# EAGLE design MonkeyParty7.1 (EAGLE 6.4)
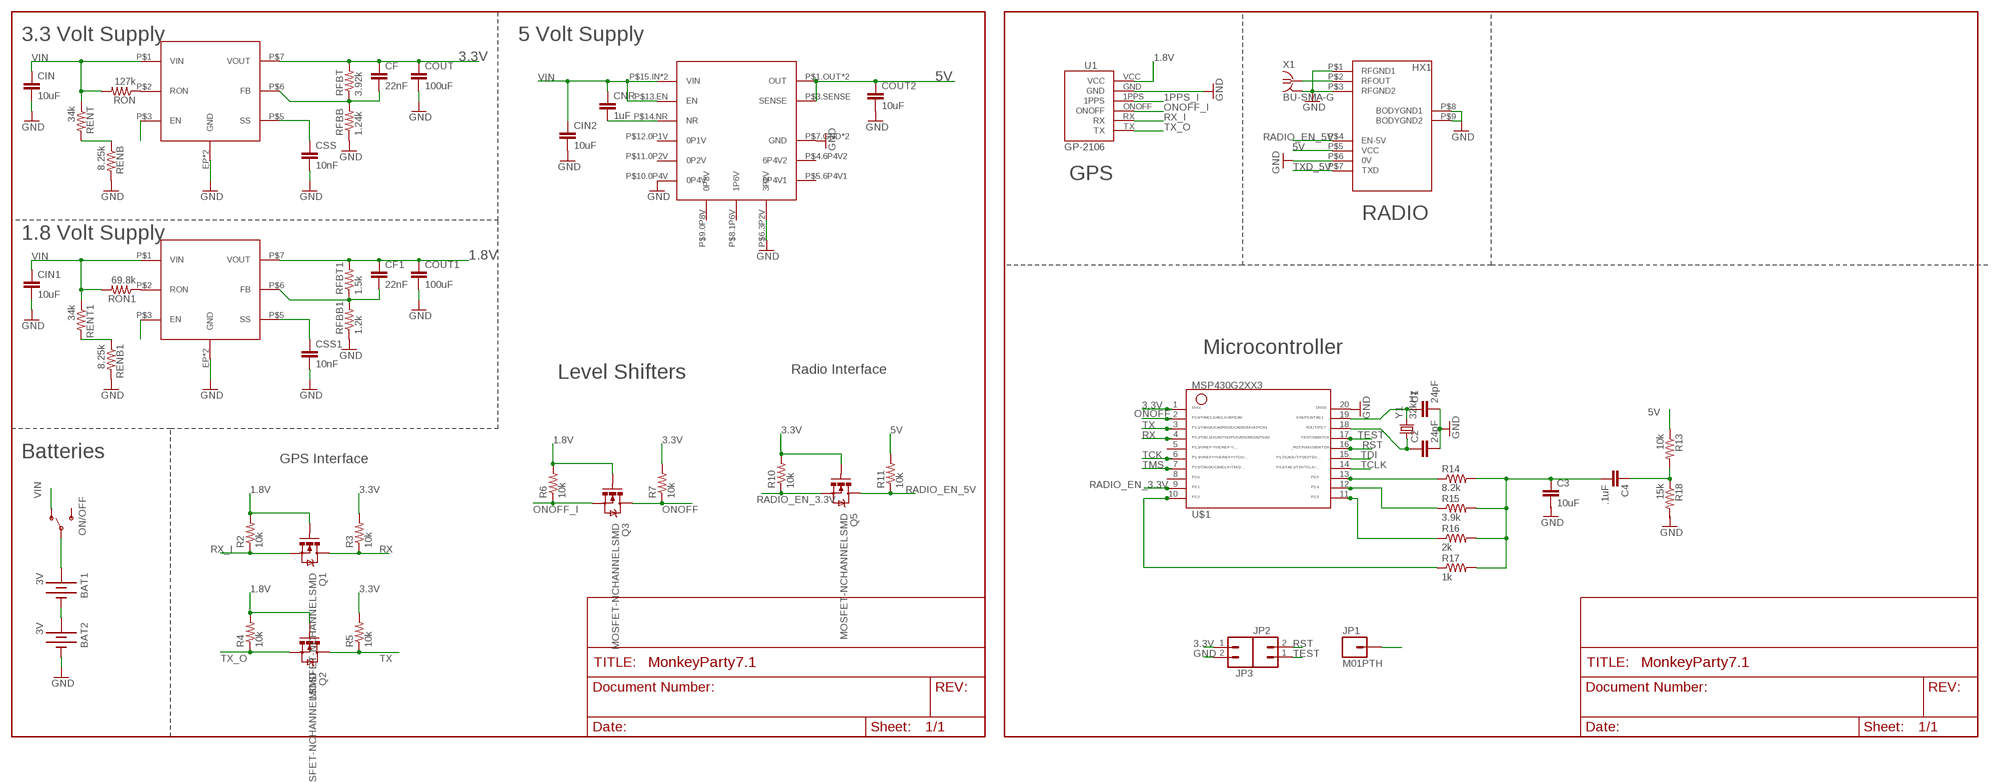
[diagram p0: schematic, sheet 1]

## Parts
1.8VREG  LMZ12001  [TO-PMOD7PIN]
3.3VREG  LMZ12001  [TO-PMOD7PIN]
5VREG  TPS7A4700  [S-PVQFN-N20]
BAT1  3V  BATTERY245MM  [BATTCON_245MM]
BAT2  3V  BATTERY245MM  [BATTCON_245MM]
C1  24pF  CAP1210  [1210]
C2  24pF  CAP1210  [1210]
C3  10uF  CAP0805  [0805]
C4  .1uF  CAP0805  [0805]
CF  22nF  CAP0805  [0805]
CF1  22nF  CAP0805  [0805]
CIN  10uF  CAP0805  [0805]
CIN1  10uF  CAP0805  [0805]
CIN2  10uF  CAP0805  [0805]
CNR  1uF  CAP0805  [0805]
COUT  100uF  CAP1210  [1210]
COUT1  100uF  CAP1210  [1210]
COUT2  10uF  CAP0805  [0805]
CSS  10nF  CAP1210  [1210]
CSS1  10nF  CAP1210  [1210]
JP1  M01PTH  [1X01]
JP2  M02PTH  [1X02]
JP3  M02PTH  [1X02]
ON/OFF  SWITCH-SPSTKIT  [SWITCH-SPDT_KIT]
Q1  MOSFET-NCHANNELSMD  [SOT23-3]
Q2  MOSFET-NCHANNELSMD  [SOT23-3]
Q3  MOSFET-NCHANNELSMD  [SOT23-3]
Q5  MOSFET-NCHANNELSMD  [SOT23-3]
R2  10k  RESISTOR0805-RES  [0805]
R3  10k  RESISTOR0805-RES  [0805]
R4  10k  RESISTOR0805-RES  [0805]
R5  10k  RESISTOR0805-RES  [0805]
R6  10k  RESISTOR0805-RES  [0805]
R7  10k  RESISTOR0805-RES  [0805]
R10  10k  RESISTOR0805-RES  [0805]
R11  10k  RESISTOR0805-RES  [0805]
R13  10k  RESISTOR0805-RES  [0805]
R14  8.2k  RESISTOR0805-RES  [0805]
R15  3.9k  RESISTOR0805-RES  [0805]
R16  2k  RESISTOR0805-RES  [0805]
R17  1k  RESISTOR0805-RES  [0805]
R18  15k  RESISTOR0805-RES  [0805]
RENB  8.25k  RESISTOR0805-RES  [0805]
RENB1  8.25k  RESISTOR0805-RES  [0805]
RENT  34k  RESISTOR0805-RES  [0805]
RENT1  34k  RESISTOR0805-RES  [0805]
RFBB  1.24k  RESISTOR0805-RES  [0805]
RFBB1  1.2k  RESISTOR0805-RES  [0805]
RFBT  3.92k  RESISTOR0805-RES  [0805]
RFBT1  1.5k  RESISTOR0805-RES  [0805]
RON  127k  RESISTOR0805-RES  [0805]
RON1  69.8k  RESISTOR0805-RES  [0805]
U1  GP-2106  [GP-2106]
U$1  G2XX3---PW20  [PW20]
U$2  HX1  [HX1]
X1  BU-SMA-G  [BU-SMA-G]
Y1  32kHz  CRYSTAL32-SMD  [CRYSTAL-32KHZ-SMD]

## Nets
1.8V: 1.8VREG.P$7(VOUT) CF1.1 COUT1.1 Q1.1(G) Q2.1(G) Q3.1(G) R2.2 R4.2 R6.2 RFBT1.2 U1.VCC
1PPS_I: U1.1PPS
3.3V: 3.3VREG.P$7(VOUT) CF.1 COUT.1 JP3.1 Q5.1(G) R3.2 R5.2 R7.2 R10.2 RFBT.2 U$1.1
5V: 5VREG.P$1.OUT(OUT) 5VREG.P$3.SENSE(SENSE) 5VREG.P$20.OUT(OUT) COUT2.1 R11.2 R13.1 U$2.P$5(VCC)
GND: 1.8VREG.EP(GND) 1.8VREG.P$4(GND) 3.3VREG.EP(GND) 3.3VREG.P$4(GND) 5VREG.P$6.3P2V(3P2V) 5VREG.P$7.GND(GND) 5VREG.P$10.0P4V(0P4V) 5VREG.P$21.GND(GND) BAT2.2(-) C1.2 C2.2 CIN1.2 CIN2.2 CIN.2 COUT1.2 COUT2.2 COUT.2 CSS1.2 CSS.2 JP3.2 RENB1.2 RENB.2 RFBB1.1 RFBB.1 U1.GND U$1.20 U$2.P$1(RFGND1) U$2.P$3(RFGND2) U$2.P$6(0V) U$2.P$8(BODYGND1) U$2.P$9(BODYGND2) X1.2 X1.3 X1.4 X1.5
N$1: 3.3VREG.P$2(RON) RON.1
N$2: U$2.P$2(RFOUT) X1.1
N$3: RENB.1 RENT.2
N$4: BAT1.2(-) BAT2.1(+)
N$5: 3.3VREG.P$5(SS) CSS.1
N$6: 3.3VREG.P$6(FB) CF.2 RFBB.2 RFBT.1
N$7: 1.8VREG.P$2(RON) RON1.1
N$8: BAT1.1(+) ON/OFF.2(P)
N$9: RENB1.1 RENT1.2
N$10: 1.8VREG.P$5(SS) CSS1.1
N$11: 1.8VREG.P$6(FB) CF1.2 RFBB1.2 RFBT1.1
N$12: 5VREG.P$14.NR(NR) CNR.2
N$14: C1.1 U$1.19 Y1.X2
N$16: C2.1 U$1.18 Y1.X1
N$20: R14.1 U$1.13
N$21: R15.1 U$1.12
N$22: R16.1 U$1.11
N$23: R17.1 U$1.10
ONOFF: Q3.3(D) R7.1 U$1.2
ONOFF_I: Q3.2(S) R6.1 U1.ONOFF
RADIO_EN_3.3V: Q5.2(S) R10.1 U$1.9
RADIO_EN_5V: Q5.3(D) R11.1 U$2.P$4(EN-5V)
RST: JP2.2 U$1.16
RX: Q1.3(D) R3.1 U$1.4
RX_I: Q1.2(S) R2.1 U1.RX
TCK: U$1.6
TCLK: U$1.14
TDI: U$1.15
TEST: JP2.1 U$1.17
TMS: U$1.7
TX: Q2.3(D) R5.1 U$1.3
TX_O: Q2.2(S) R4.1 U1.TX
TXD_3.3V: C3.1 C4.2 R14.2 R15.2 R16.2 R17.2
TXD_5V: C4.1 R13.2 R18.1 U$2.P$7(TXD)
VIN: 1.8VREG.P$1(VIN) 1.8VREG.P$3(EN) 3.3VREG.P$1(VIN) 3.3VREG.P$3(EN) 5VREG.P$13.EN(EN) 5VREG.P$15.IN(VIN) 5VREG.P$16.IN(VIN) CIN1.1 CIN2.1 CIN.1 CNR.1 JP1.1 ON/OFF.1(O) RENT1.1 RENT.1 RON1.2 RON.2
Unconnected: 5VREG.P$4.6P4V2(6P4V2) 5VREG.P$5.6P4V1(6P4V1) 5VREG.P$8.1P6V(1P6V) 5VREG.P$9.0P8V(0P8V) 5VREG.P$11.0P2V(0P2V) 5VREG.P$12.0P1V(0P1V) C3.2 ON/OFF.3(S) R18.2 U$1.5 U$1.8

## Notes on the sheet
- 3.3 Volt Supply | 5 Volt Supply
- GPS
- RADIO
- 1.8 Volt Supply
- Microcontroller
- Radio Interface
- Level Shifters
- Batteries
- GPS Interface

## Library data of the parts
1.8VREG 3.3VREG = Senior Design:LMZ12001
5VREG = Senior Design:TPS7A4700
BAT1 BAT2 = SparkFun:BATTERY: Battery Holders Various common sizes : AA, AAA, 20mm coin cell and 12mm coin cell.
C1 C2 CF CF1 CIN CIN1 CIN2 CNR COUT COUT1 COUT2 CSS CSS1 = SparkFun:CAP: Capacitor Standard 0603 ceramic capacitor, and 0.1" leaded capacitor.
C3 C4 = SparkFun-Capacitors:CAP: Capacitor Standard 0603 ceramic capacitor, and 0.1" leaded capacitor.
JP1 = SparkFun:M01: Header 1 Standard 1-pin 0.1" header. Use with straight break away headers (SKU : PRT-00116), right angle break away headers (PRT-00553), swiss pins (PRT-00743), machine pins (PRT-00117), and female headers (PRT-00115).
JP2 JP3 = SparkFun:M02: Header 2 Standard 2-pin 0.1" header. Use with straight break away headers (SKU : PRT-00116), right angle break away headers (PRT-00553), swiss pins (PRT-00743), machine pins (PRT-00117), and female headers (PRT-00115). Molex polarized connector foot print use with SKU : PRT-08233 with associated crimp pins and housings.
ON/OFF = SparkFun:SWITCH-SPST: SPST Switch Simple slide switch. Spark Fun Electronics SKU : COM-00102
Q1-Q3 Q5 = SparkFun:MOSFET-NCHANNEL
R2-R7 R10 R11 R14-R17 RENB RENB1 RENT RENT1 RFBB RFBB1 RFBT RFBT1 RON RON1 = SparkFun:RESISTOR: Resistor Basic schematic elements and footprints for 0603, 1206, and PTH resistors.
R13 R18 = SparkFun-Resistors:RESISTOR: Resistor Basic schematic elements and footprints for 0603, 1206, and PTH resistors.
U1 = SparkFun:GP-2106: GP-2106 GPS SiRF IV
U$1 = TI_MSP430_v16:G2XX3---PW20: MSP430G2XX1 TSSOP (PW) 20 Pin Package
U$2 = HX1:HX1: Radiometrix HX1
X1 = con-coax:BU-SMA-G: FEMALE SMA CONNECTOR Radiall distributor RS 193-9117; OC_FARNELL: unknown; OC_NEWARK: unknown
Y1 = SparkFun:CRYSTAL: Crystals Various standard crystals. Proven footprints. Spark Fun Electronics SKU : COM-00534

## Board
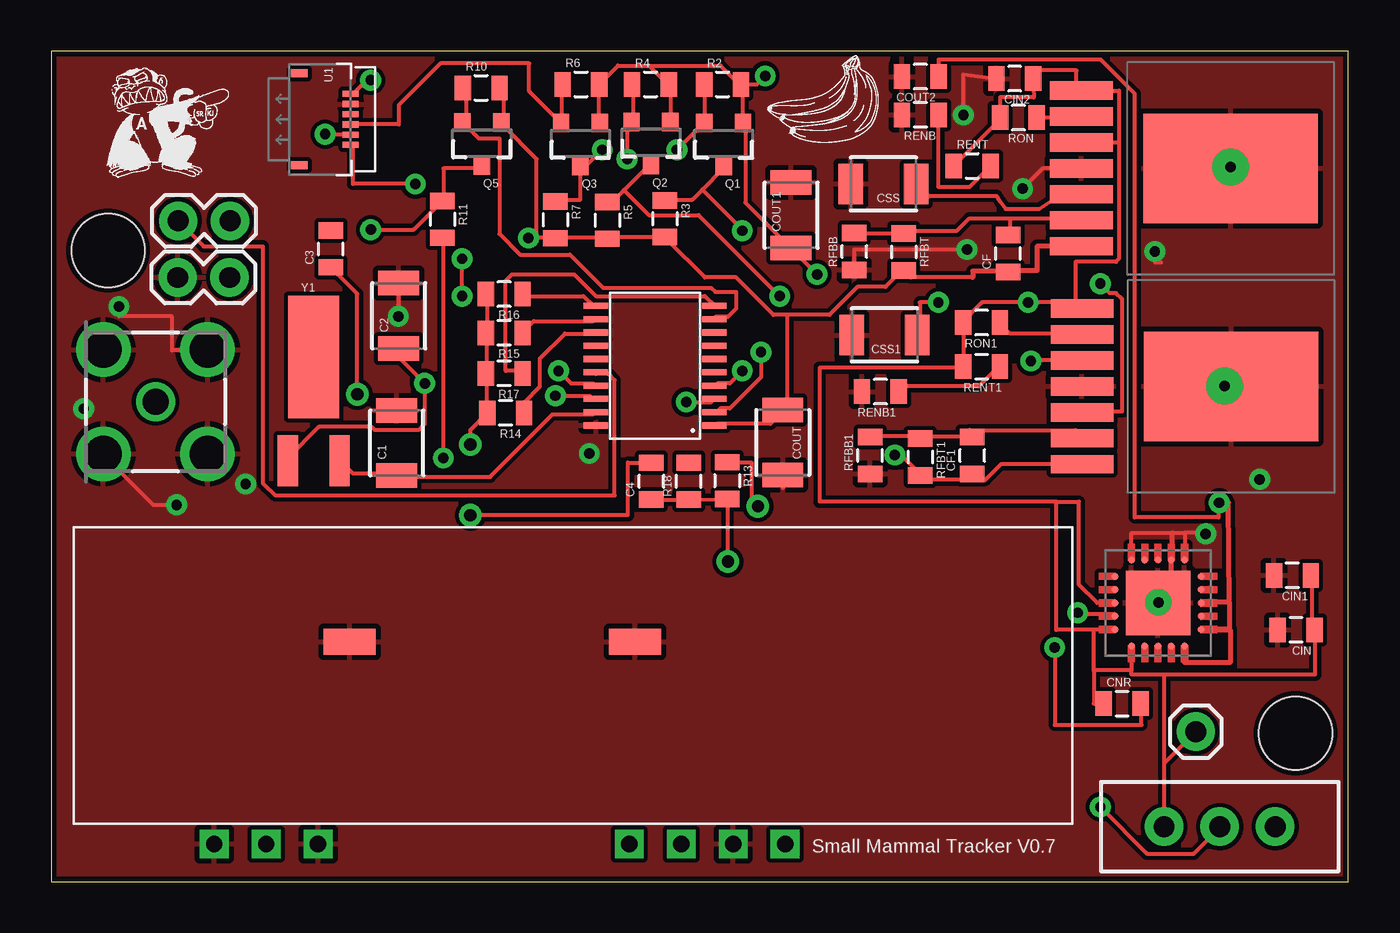
[diagram p1: board, top side]
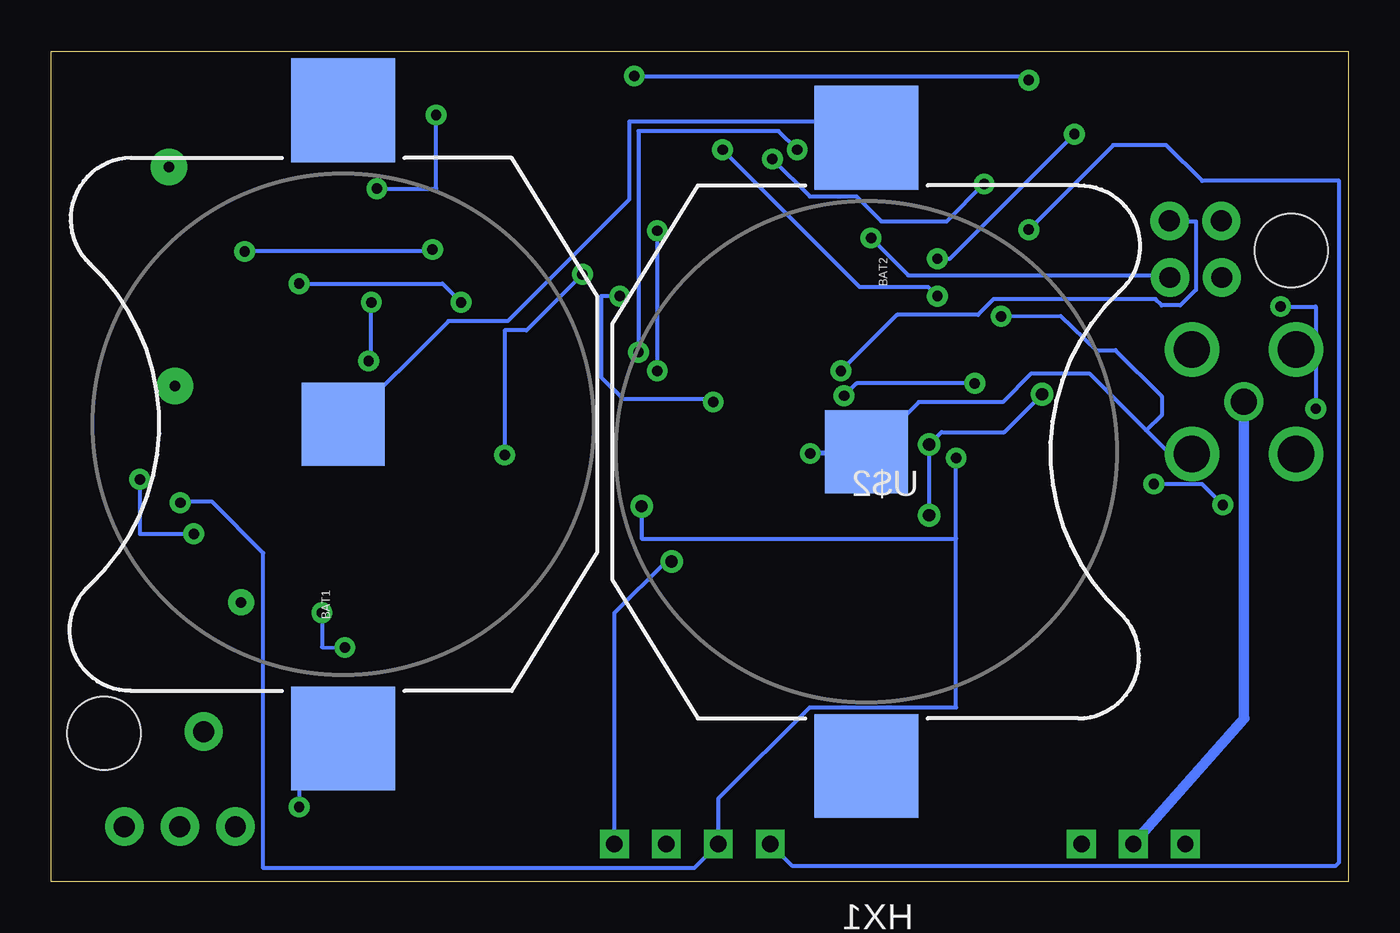
[diagram p2: board, bottom side, seen from below]

Size 63.5 x 40.64 mm. Coordinates in mm from the lower left corner, seen from the top.
Outline: 0,0 63.5,0 63.5,40.64 0,40.64 0,0
Copper layers (1*16): Top 0.035mm / dielectric 1.5mm / Bottom 0.035mm
Design rules "SparkFun": minimum track width 8mil, minimum drill 20mil, track to track 8mil, track to pad 8mil, pad to pad 8mil, via to via 8mil, smd to smd 8mil, copper to edge 10mil, drill to drill 8mil, minimum pad ring 12mil, minimum via ring 10mil, stop-mask expansion 4mil, vias tented up to drill 25mil, thermal gap 10mil
Holes 3.58 mm at 2.79,30.89 60.91,7.26

### Footprints (pad centres in the part's own frame; a part is rotated, then mirrored left to right if it is on the bottom)
TO-PMOD7PIN = smd 5.35 x 8.54: EP 0,0 | smd 0.89 x 3.06: P$1 -3.81,-7.305; P$2 -2.54,-7.305; P$3 -1.27,-7.305; P$4 0,-7.305; P$5 1.27,-7.305; P$6 2.54,-7.305; P$7 3.81,-7.305
S-PVQFN-N20 = smd 0.35 x 0.35: P$1.OUT -2.1,1.3; P$2.NC -2.1,0.65; P$3.SENSE -2.1,0; P$4.6P4V2 -2.1,-0.65; P$5.6P4V1 -2.1,-1.3; P$6.3P2V -1.3,-2.1; P$7.GND -0.65,-2.1; P$8.1P6V 0,-2.1; P$9.0P8V 0.65,-2.1; P$10.0P4V 1.3,-2.1; P$11.0P2V 2.1,-1.3; P$12.0P1V 2.1,-0.65; P$13.EN 2.1,0; P$14.NR 2.1,0.65; P$15.IN 2.1,1.3; P$16.IN 1.3,2.1; P$17.NC 0.65,2.1; P$18.NC 0,2.1; P$19.NC -0.65,2.1; P$20.OUT -1.3,2.1 | smd 3.15 x 3.15: P$21.GND 0,0
BATTCON_245MM = smd 5.08 x 5.08: 1 -15.367,0; 3 15.367,0 | smd 4.064 x 4.064: 2 0,0
1210 = smd 1.2 x 2: 1 -1.6,0; 2 1.6,0
0805 = smd 0.8 x 1.2: 1 -0.9,0; 2 0.9,0
1X01 = drill 1.016 pad 1.88: 1 0,0
1X02 = drill 1.016 pad 1.88: 1 0,0; 2 2.54,0
SWITCH-SPDT_KIT = drill 1.016 pad 1.88: 1 0,2.718; 2 0,0; 3 0,-2.718
SOT23-3 = smd 0.8 x 0.9: 1 -0.95,-1; 2 0.95,-1; 3 0,1.1
GP-2106 = smd 0.3 x 0.8: 1PPS -0.25,0; GND -0.75,0; ONOFF 0.25,0; RX 0.75,0; TX 1.25,0; VCC -1.25,0 | smd 0.4 x 0.8: P$7 -2.25,-2.5; P$8 2.25,-2.5
PW20 = smd 0.3 x 1.2: 1 -2.925,-2.9; 2 -2.275,-2.9; 3 -1.625,-2.9; 4 -0.975,-2.9; 5 -0.325,-2.9; 6 0.325,-2.9; 7 0.975,-2.9; 8 1.625,-2.9; 9 2.275,-2.9; 10 2.925,-2.9; 11 2.925,2.9; 12 2.275,2.9; 13 1.625,2.9; 14 0.975,2.9; 15 0.325,2.9; 16 -0.325,2.9; 17 -0.975,2.9; 18 -1.625,2.9; 19 -2.275,2.9; 20 -2.925,2.9
HX1 = drill 0.8 square: P$1 1,-1; P$2 3.54,-1; P$3 6.08,-1; P$4 21.32,-1; P$5 23.86,-1; P$6 26.4,-1; P$7 28.94,-1 | smd 2.54 x 1.27: P$8 7.62,8.89; P$9 21.59,8.89
BU-SMA-G = drill 1.27: 1 0,0 | drill 1.778: 2 -2.55,2.55; 3 2.55,2.55; 4 2.55,-2.55; 5 -2.55,-2.55
CRYSTAL-32KHZ-SMD = smd 2.5 x 6: SHEILD 0,5.08 | smd 1 x 2.5: X1 -1.27,0; X2 1.27,0

### Placement (x,y rotation side)
1.8VREG  57.76,24.23 270 top
3.3VREG  57.73,34.9 270 top
5VREG  54.18,13.64 180 top
BAT1  49.2,22.38 90 bottom
BAT2  23.6,21.03 270 bottom
C1  16.92,21.46 90 top
C2  17.02,27.69 90 top
C3  13.69,30.96 90 top
C4  29.39,19.6 90 top
CF  46.84,30.73 90 top
CF1  45.09,20.85 90 top
CIN  60.93,12.32 180 top
CIN1  60.76,14.99 180 top
CIN2  47.17,39.29 180 top
CNR  52.43,8.71 0 top
COUT  35.81,21.49 270 top
COUT1  36.22,32.61 90 top
COUT2  42.55,39.4 180 top
CSS  40.74,34.14 180 top
CSS1  40.79,26.75 180 top
JP1  56.03,7.34 0 top
JP2  8.76,32.33 180 top
JP3  8.74,29.57 180 top
ON/OFF  57.2,2.69 90 top
Q1  32.92,36.12 180 top
Q2  29.36,36.17 180 top
Q3  25.91,36.12 180 top
Q5  21.08,36.14 180 top
R2  32.87,39.01 0 top
R3  30.05,32.44 270 top
R4  29.34,39.01 0 top
R5  27.23,32.36 270 top
R6  25.93,39.01 0 top
R7  24.69,32.38 270 top
R10  21.05,38.84 0 top
R11  19.15,32.41 270 top
R13  33.1,19.62 270 top
R14  22.25,22.94 180 top
R15  22.17,26.85 180 top
R16  22.17,28.75 180 top
R17  22.17,24.87 180 top
R18  31.21,19.6 90 top
RENB  42.55,37.52 180 top
RENB1  40.59,23.98 180 top
RENT  45.09,35.03 0 top
RENT1  45.54,25.2 0 top
RFBB  39.32,30.84 90 top
RFBB1  40.08,20.85 90 top
RFBT  41.73,30.81 270 top
RFBT1  42.55,20.78 270 top
RON  47.35,37.39 180 top
RON1  45.54,27.36 180 top
U1  14.66,37.3 270 top
U$1  29.57,25.25 90 top
U$2  6.99,2.84 0 top
X1  5.11,23.48 180 top
Y1  12.85,20.6 0 top

### Tracks (layer width: path | path; a pad name or v marks a point on that pad's centre or on a via)
1.8V  (via drill 0.51)
  Top 0.203: 45.57,19.66 45.11,19.66 | 45.11,19.66 42.82,19.66 42.67,19.81 RFBT1.2 42.52,19.96 41.6,20.88 v41.3,20.88 | 1.8VREG.P$7 46.48,20.42 45.72,19.66 45.57,19.66 | R2.2 33.83,39.01 33.83,37.19 Q1.1 33.98,37.03 33.98,33.22 36.12,31.09 COUT1.1 36.27,30.94 v37.49,29.72 | Q2.1 30.33,37.19 30.33,39.01 R4.2 30.18,39.01 29.26,39.93 | Q3.1 26.82,37.19 R6.2 27.75,39.93 29.26,39.93 | 29.26,39.93 32.77,39.93 33.68,39.01 R2.2 | 45.11,19.66 45.11,19.81 CF1.1 45.57,19.66 | v15.65,39.22 15.44,39.22 14.83,38.61 U1.VCC | v34.95,39.42 34.54,39.01 R2.2
  Bottom 0.203: v41.3,20.88 41.3,26.98 40.23,26.98 v37.49,29.72 | v15.65,39.22 15.85,39.42 v34.95,39.42
3.3V  (via drill 0.51)
  Top 0.203: 45.11,29.57 42.06,29.57 41.76,29.87 RFBT.2 41.6,29.87 40.84,29.11 39.47,29.11 38.1,27.74 36.04,27.74 | U$1.1 32.61,22.4 35.2,22.4 35.81,23.01 COUT.1 35.81,23.16 36.04,23.16 36.04,27.74 | 46.79,29.87 CF.1 | 36.04,27.74 35.36,27.74 33.53,29.57 32,29.57 30.18,31.39 R3.2 30.02,31.55 27.28,31.55 R5.2 27.23,31.5 24.79,31.5 R7.2 24.59,31.5 23.77,31.5 | R10.2 22.15,38.81 22.15,37.19 Q5.1 22.15,36.98 23.77,35.36 23.77,31.5 | 23.77,31.5 v23.37,31.5
  Top 0.254: 3.3VREG.P$7 48.26,31.09 48.26,29.9 46.84,29.9 CF.1 | 46.79,29.87 45.11,29.87 45.11,29.57
  Bottom 0.203: v23.37,31.5 21.54,29.67 8.74,29.67 JP3.1
5V  (via drill 0.51, 0.6)
  Top 0.203: v57.17,18.54 57.15,17.83 53.03,17.83 53.03,38.56 51.36,40.23 43.45,40.23 COUT2.1 | v19.2,20.73 19.2,31.39 R11.2 | R13.1 34.28,20.52 34.28,18.69 v34.59,18.37
  Top 0.254: 5VREG.P$3.SENSE 56.28,13.69 57.66,13.69 | 57.66,13.69 57.66,12.34 5VREG.P$1.OUT 56.28,12.32 57.71,12.32 57.71,10.72 55.47,10.72 5VREG.P$20.OUT | 57.66,13.69 57.63,18.54 v57.17,18.54
  Bottom 0.203: 19.2,16.79 19.2,8.53 26.36,8.53 30.84,4.05 U$2.P$5 32.03,0.66 53.11,0.66 53.11,16.08 55.63,18.59 57.12,18.59 v57.17,18.54 | 19.2,16.79 v19.2,20.73 | 19.2,16.79 34.59,16.79 v34.59,18.37
GND  (via drill 0.51)
  Top 0.203: COUT.2 35.81,19.25 | 5VREG.P$10.0P4V 52.88,17.07 54.89,17.07 55.5,17.07 | 55.5,17.07 55.5,15.74 5VREG.P$6.3P2V | 59.05,19.68 v59.16,19.68 | v56.52,17.02 56.52,17.07 55.5,17.07 | 3.3VREG.P$4 48.54,34.9 v47.55,33.91 | v44.65,37.52 44.65,39.5 CIN2.2 | 2.56,20.89 5.01,18.44 v6.15,18.44 | 7.66,25.99 5.92,25.99 5.92,27.66 3.33,27.66 v3.33,28.14 | v1.6,23.14 1.6,22.78 1.57,22.76 | RFBB.1 39.32,30.94 v44.83,30.94 | v54.03,30.84 54.03,30.3 54.33,30.3 | 17.07,27.69 17.02,27.74 C2.2 v16.99,27.66
  Top 0.254: 5VREG.P$21.GND 54.18,13.79 54.81,13.79 54.81,15.74 5VREG.P$7.GND 54.89,15.74 54.89,17.07
  Bottom 0.203: 9.89,22.09 8.84,21.03 7.77,21.03 | 9.89,22.09 12.65,24.84 15.54,24.84 16.92,23.47 21.03,23.47 23.47,21.03 BAT2.2 | v59.16,19.68 59.16,17.02 v56.52,17.02 | v47.55,33.91 44.65,33.91 v44.65,37.52 | v6.15,18.44 7.16,19.46 v9.53,19.46 | v3.33,28.14 1.6,28.14 v1.6,23.14 | v44.83,30.94 44.83,30.84 v54.03,30.84 | v16.99,27.66 14.1,27.69 12.34,26.01 11.4,26.01 9.14,23.75 9.14,22.84 9.89,22.09
  Bottom 0.254: BAT2.2 23.6,20.95 v26.34,20.95
  pour Top: 0,40.64 -0.03,-0.03 63.58,-0.05 63.5,40.67
N$1
  Top 0.203: 3.3VREG.P$2 50.29,37.34 50.29,37.39 RON.1
N$2
  Bottom 0.203: 5.11,8
  Bottom 0.508: U$2.P$2 5.11,8 | 5.11,8 X1.1
N$3
  Top 0.203: RENT.2 45.87,34.9 44.96,33.98 43.43,33.98 43.43,37.52 RENB.1
N$4
  Bottom 0.203: BAT2.1 24.38,37.19 35.2,37.19 35.2,33.38 41.15,27.43 44.04,27.43 49.07,22.4 BAT1.2
N$5
  Top 0.203: CSS.1 42.37,34.14 42.98,33.53 42.98,33.55 46.28,33.55 46.43,33.3 46.71,32.92 48.36,32.92 49.25,33.5 50.3,33.5 3.3VREG.P$5 50.29,33.53
N$6
  Top 0.203: RFBB.2 39.47,31.55 39.62,31.7 41.6,31.7 RFBT.1 41.76,31.85 44.35,31.85 44.96,32.46 46.94,32.46 | 46.94,32.46 50.29,32.46 3.3VREG.P$6 | 46.94,32.46 46.94,31.7 CF.2
N$7
  Top 0.203: RON1.1 46.48,27.28 46.94,26.82 50.44,26.82 1.8VREG.P$2
N$8  (via drill 0.51)
  Top 0.203: v51.36,3.66 53.65,1.37 55.93,1.37 57.15,2.59 ON/OFF.2
  Bottom 0.203: v51.36,3.66 51.36,7.01 BAT1.1
N$9
  Top 0.203: RENB1.1 41.6,24.08 41.76,24.23 45.41,24.23 46.33,25.15 RENT1.2
N$10  (via drill 0.51)
  Top 0.203: v43.43,28.35 42.52,28.35 42.52,26.82 CSS1.1 | v51.36,29.26 51.82,28.8 52.12,28.8 52.43,28.5 52.43,23.01 50.6,23.01 1.8VREG.P$5
  Bottom 0.203: v43.43,28.35 44.35,29.26 v51.36,29.26
N$11
  Top 0.203: RFBB1.2 40.08,21.79 42.52,21.79 RFBT1.1 42.67,21.79 44.65,21.79 44.81,21.95 | 44.81,21.95 44.96,22.1 50.14,22.1 50.44,21.79 1.8VREG.P$6 | 44.81,21.95 44.96,21.79 CF1.2
N$12  (via drill 0.51)
  Top 0.203: 5VREG.P$14.NR 52.08,13.08 50.24,13.08 v50.24,13.16 | v49.12,11.46 49.12,7.67 53.37,7.67 53.37,8.71 CNR.2
  Bottom 0.203: v50.24,13.16 50.24,11.48 v49.12,11.46
N$14
  Top 0.203: U$1.19 26.52,22.86 24.54,22.86 21.49,19.81 16.92,19.81 C1.1 16.92,19.96 14.78,19.96 14.17,20.57 Y1.X2
N$16  (via drill 0.51)
  Top 0.203: v24.69,23.77 26.36,23.77 26.52,23.62 U$1.18 | Y1.X1 11.58,20.73 13.11,22.25 15.7,22.25 15.85,22.1 17.98,22.1 18.29,22.4 v18.29,24.38 17.02,25.65 C2.1
  Bottom 0.203: v24.69,23.77 24.08,24.38 v18.29,24.38
N$17  (via drill 0.51 pad 1.78)
  other vias: 57.43,24.26
N$20
  Top 0.203: U$1.13 26.52,26.82 25.15,26.82 23.93,25.6 23.93,24.23 23.16,23.47 23.16,23.01 R14.1
N$21
  Top 0.203: U$1.12 26.52,27.43 23.62,27.43 23.16,26.98 R15.1
N$22
  Top 0.203: U$1.11 26.52,28.19 26.06,28.65 23.16,28.65 R16.1
N$23
  Top 0.203: U$1.10 32.46,28.19 32,28.65 26.67,28.65 25.6,29.72 22.55,29.72 22.25,29.41 22.25,24.99 23.01,24.99 R17.1
N$24  (via drill 0.51 pad 1.78)
  other vias: 57.73,34.98
N$26  (via drill 0.51 pad 1.27)
  other vias: 54.2,13.67
ONOFF  (via drill 0.51)
  Top 0.203: R7.1 24.69,33.38 25.91,33.38 Q3.3 25.91,35.05 26.21,35.05 v26.98,35.81 | v34.75,25.91 34.75,24.69 33.22,23.16 32.77,23.16 32.61,23.01 U$1.2
  Bottom 0.203: v34.75,25.91 34.75,36.73 27.89,36.73 v26.98,35.81
ONOFF_I
  Top 0.203: R6.1 24.99,39.01 24.99,37.19 Q3.2 23.4,38.68 23.4,40.04 19.06,40.04 17.01,37.99 17.01,37.05 U1.ONOFF
RADIO_EN_3.3V
  Top 0.203: R10.1 20.32,38.81 20.32,37.19 Q5.2 20.32,36.98 20.93,36.37 21.95,36.37 21.95,31.7 22.96,30.68 25.4,30.68 27.03,29.06 32.31,29.06 32.51,28.85 33.53,28.85 33.53,28.04 33.12,27.64 32.51,27.64 U$1.9
RADIO_EN_5V  (via drill 0.51)
  Top 0.203: v15.65,31.9 17.74,31.9 R11.1 19.2,33.38 19.2,34.9 20.94,34.9 Q5.3
  Bottom 0.203: U$2.P$4 27.25,0.79 0.61,0.79 0.46,0.94 0.46,34.29 7.16,34.29 8.91,36.04 11.51,36.04 v15.65,31.9
RST
  Top 0.203: JP2.2 7.47,31.09 10.36,31.09 10.36,19.51 10.97,18.9 27.58,18.9 27.58,24.54 27.28,24.84 26.67,24.84 U$1.16
RX  (via drill 0.51)
  Top 0.203: 31.88,33.86 31.39,33.38 30.18,33.38 R3.1 | 31.88,33.86 32.92,34.9 Q1.3 | v33.83,24.99 33.22,24.38 32.61,24.38 U$1.4 | v33.83,31.85 33.83,31.9 31.88,33.86
  Bottom 0.203: v33.83,31.85 v33.83,24.99
RX_I  (via drill 0.51)
  Top 0.203: R2.1 32,39.01 32,37.19 Q1.2 31.85,37.03 v30.63,35.81 | v13.41,36.58 14.63,36.58 U1.RX | v20.12,28.65 v20.12,30.48
  Bottom 0.203: v13.41,36.58 19.51,30.48 v20.12,30.48 | v20.12,28.65 20.57,29.11 23.93,29.11 v30.63,35.81
TEST  (via drill 0.51)
  Top 0.203: v24.84,24.99 25.45,24.38 26.52,24.38 U$1.17
  Bottom 0.203: v24.84,24.99 22.1,27.74 18.14,27.74 17.37,28.5 9.45,28.5 9.14,28.19 8.23,28.19 7.47,28.96 7.47,32.31 8.69,32.31 JP2.1
TX  (via drill 0.51)
  Top 0.203: 28.04,33.83 27.58,33.38 27.28,33.38 R5.1 | 28.04,33.83 29.26,35.05 Q2.3 | v31.09,23.47 32.31,23.47 U$1.3 | v35.66,28.65 31.7,32.61 29.26,32.61 28.04,33.83
  Bottom 0.203: v31.09,23.47 31.24,23.62 35.51,23.62 36.58,24.69 36.58,28.65 v35.66,28.65
TX_O  (via drill 0.51)
  Top 0.203: R4.1 28.5,39.01 28.5,37.19 Q2.2 28.35,37.03 28.19,37.03 v28.19,35.36 | v17.83,34.14 14.78,34.14 14.78,35.97 U1.TX
  Bottom 0.203: v17.83,34.14 19.66,32.31 22.86,32.31 24.08,33.53 26.36,33.53 v28.19,35.36
TXD_3.3V  (via drill 0.6)
  Top 0.203: R16.2 21.34,28.65 21.34,26.98 R15.2 21.34,26.82 21.34,24.99 R17.2 21.34,24.84 21.34,23.01 R14.2 20.52,22.11 v20.52,21.39 | v20.52,17.93 28.24,17.93 28.24,20.51 C4.2 | v14.99,23.85 14.99,28.77 C3.1
  Bottom 0.203: v14.99,23.85 16.84,22 19.91,22 v20.52,21.39 v20.52,17.93
TXD_5V  (via drill 0.6)
  Top 0.203: C4.1 R18.1 R13.2 33.12,18.7 33.12,15.68 v33.13,15.66
  Bottom 0.203: U$2.P$7 35.92,13.15 33.41,15.66 v33.13,15.66
VIN  (via drill 0.51)
  Top 0.203: 51.66,8.84 CNR.1 51.03,8.71 51.03,10.34 | 50.14,28.35 v47.83,28.35 45.57,28.35 44.65,27.43 RON1.2 44.65,27.28 44.65,25.3 RENT1.1 44.5,25.15 37.62,25.15 37.62,18.59 49.2,18.59 | 50.14,28.35 1.8VREG.P$1 50.14,28.35 | 50.14,28.35 50.14,30.33 52.12,30.33 52.27,30.48 52.27,36.17 | 52.27,36.17 52.27,38.71 3.3VREG.P$1 50.19,38.71 50.19,39.7 48.07,39.7 CIN2.1 48.09,38.38 46.45,38.38 RON.2 | 49.2,18.59 50.32,18.59 50.32,14.53 51.21,13.64 5VREG.P$13.EN | 5VREG.P$15.IN 52.08,12.32 51.03,12.32 | 51.03,12.32 49.2,12.32 49.2,18.59 | 5VREG.P$16.IN 52.88,10.34 | 52.88,10.34 51.03,10.34 | 51.03,10.34 51.03,12.32 | 52.88,10.34 52.88,10.13 54.46,10.13 | ON/OFF.1 54.48,5.79 | RON.2 | RENT.1 46.45,37.29 RON.2 | CIN1.1 61.72,14.94 61.72,12.34 CIN.1 61.87,12.19 61.87,10.13 54.46,10.13 | 1.8VREG.P$3 47.95,25.5 v47.95,25.48 | 3.3VREG.P$3 52.27,36.17 | 54.48,5.79 JP1.1 | 54.48,5.79 54.48,10.11 54.46,10.13
  Top 0.254: 52.86,11.54 5VREG.P$16.IN
  Bottom 0.203: v47.95,25.48 47.83,25.48 v47.83,28.35

### Text on the board
tNames: Small Mammal Tracker V0.7